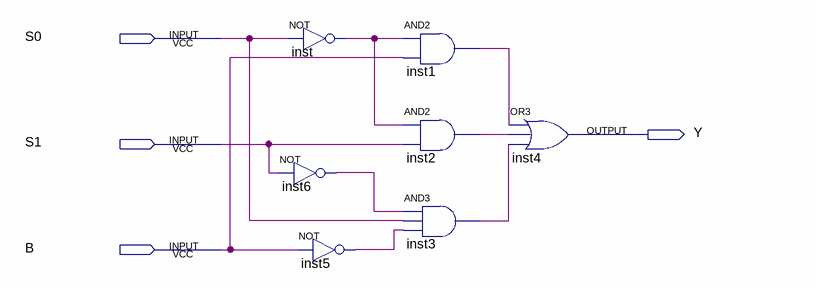
[diagram p0: schematic sheet]
// Quartus schematic BLogic.bdf as structural Verilog: 7 symbols, 4 pins
module BLogic (
  input  S0,
  input  S1,
  input  B,
  output Y
);

  wire inst1_out, inst2_out, inst3_out, inst5_out, inst6_out, inst_out;

  not inst (inst_out, S0);
  not inst6 (inst6_out, S1);
  not inst5 (inst5_out, B);
  and inst1 (inst1_out, inst_out, B);
  and inst2 (inst2_out, inst_out, S1);
  and inst3 (inst3_out, inst6_out, S0, inst5_out);
  or inst4 (Y, inst1_out, inst2_out, inst3_out);
endmodule
